# Altium schematic sheet Key_Reset.SchDoc
size 50 x 63 mm
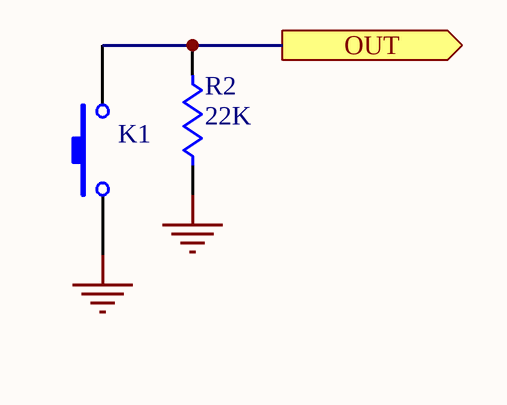
[diagram p0: Key_Reset.SchDoc]

## Parts
K1  SW-PB  [SPST-2_2]  (value not drawn)
R2  22K  [0805]

## Ports
OUT (out)

## Nets
GND: K1.1 R2.1
OUT: K1.2 R2.2 ; port OUT

## Library data of the parts
K1 = SW-PB: Switch; Manufacturer: Generic Components; Published: 24-Mar-1999; Revision: July-2002: Re-released for DXP Platform.; Publisher: Altium Limited
R2 = Res1: Resistor; Manufacturer: Generic Components; Class I: Passive; Published: 8-Jun-2000; Revision: July-2002: Re-released for DXP Platform.; Publisher: Altium Limited; Class II: Resistor